# Altium project Gagabiro_POC_amp.PrjPcb
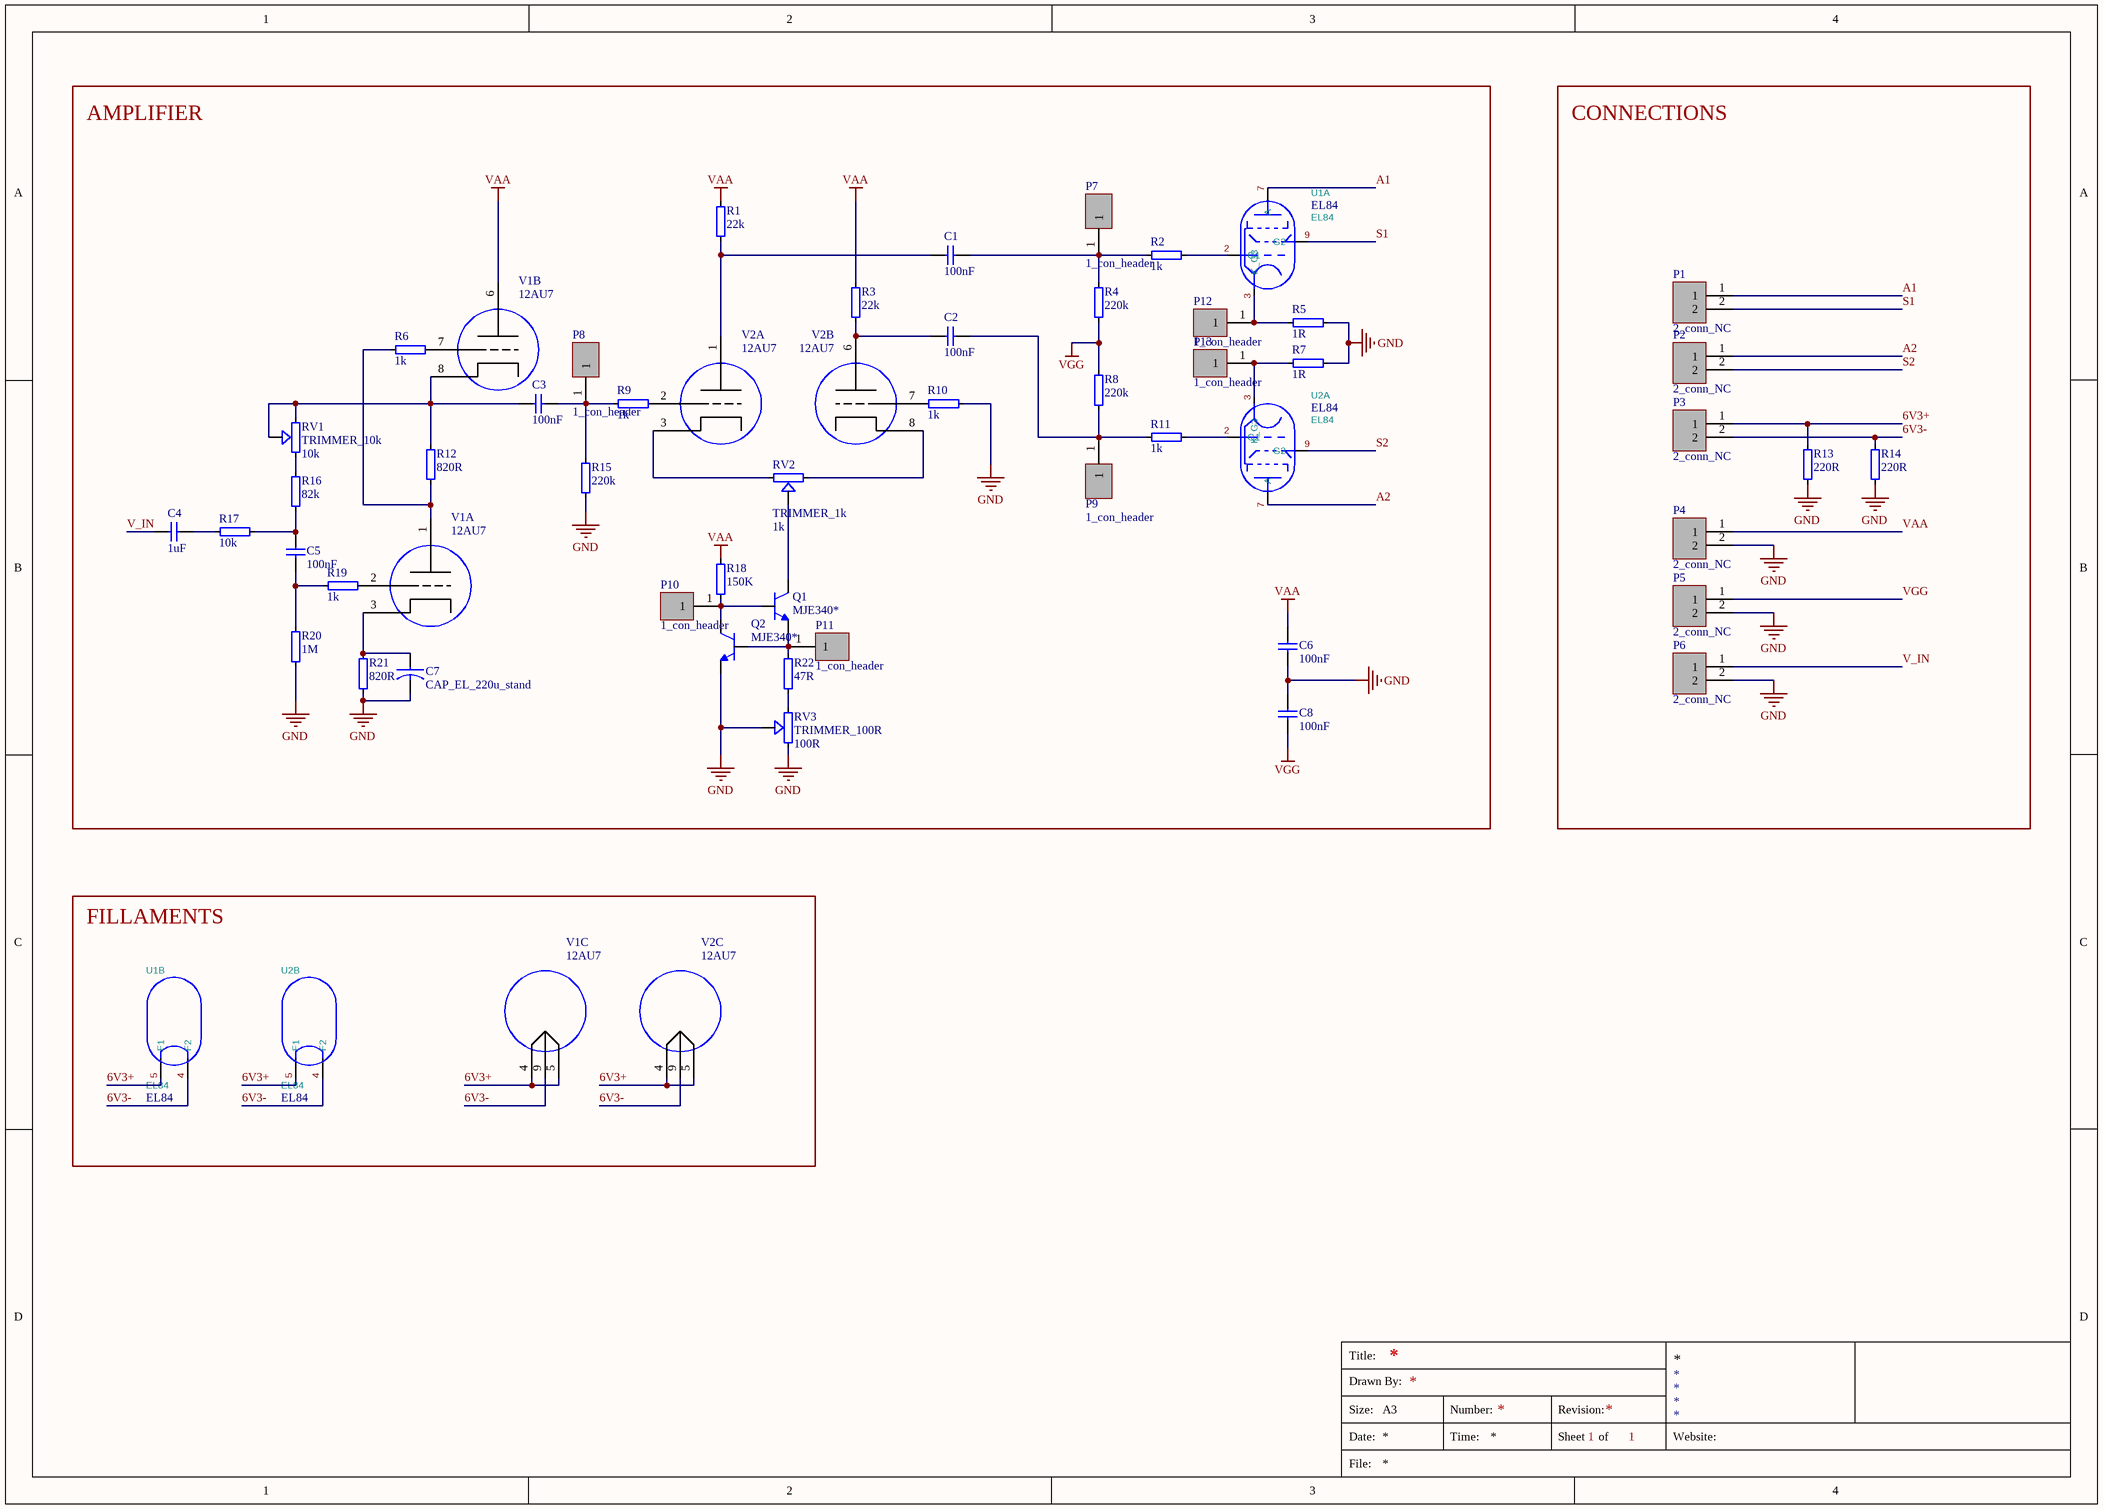
[diagram p0: Gagabiro_POC_amp_main.SchDoc]
1 sheet, 52 parts. Net scope: global (net labels, ports and power ports of the same name join across sheets).
Board file: Gagabiro_POC_amp.PcbDoc

## Sheet Gagabiro_POC_amp_main.SchDoc
size 393 x 281 mm; SheetNumber: 1; SheetTotal: 1

### Parts
C1  100nF  [CAP_panassonic_100n_450V]
C2  100nF  [CAP_panassonic_100n_450V]
C3  100nF  [CAP_panassonic_100n_450V]
C4  1uF  [CAP_panassonic_1u_450V]
C5  100nF  [CAP_panassonic_100n_450V]
C6  100nF  [CAP_panassonic_100n_450V]
C7  CAP_EL_220u_stand  [CAPPRD500W50D630H1120_stand]
C8  100nF  [CAP_panassonic_100n_450V]
P1  2_conn_NC  [2_conn_NC]
P2  2_conn_NC  [2_conn_NC]
P3  2_conn_NC  [2_conn_NC]
P4  2_conn_NC  [2_conn_NC]
P5  2_conn_NC  [2_conn_NC]
P6  2_conn_NC  [2_conn_NC]
P7  1_con_header  [SAMTEC_MTMM-101-X-X-S-X]
P8  1_con_header  [SAMTEC_MTMM-101-X-X-S-X]
P9  1_con_header  [SAMTEC_MTMM-101-X-X-S-X]
P10  1_con_header  [SAMTEC_MTMM-101-X-X-S-X]
P11  1_con_header  [SAMTEC_MTMM-101-X-X-S-X]
P12  1_con_header  [SAMTEC_MTMM-101-X-X-S-X]
P13  1_con_header  [SAMTEC_MTMM-101-X-X-S-X]
Q1  MJE340*  [TO126]
Q2  MJE340*  [TO126]
R1  22k  [RES_2W_vertical]
R2  1k  [RES_2W_vertical]
R3  22k  [RES_2W_vertical]
R4  220k  [RES_2W_vertical]
R5  1R  [RES_2W_vertical]
R6  1k  [RES_2W_vertical]
R7  1R  [RES_2W_vertical]
R8  220k  [RES_2W_vertical]
R9  1k  [RES_2W_vertical]
R10  1k  [RES_2W_vertical]
R11  1k  [RES_2W_vertical]
R12  820R  [RES_2W_vertical]
R13  220R  [RES_2W_vertical]
R14  220R  [RES_2W_vertical]
R15  220k  [RES_2W_vertical]
R16  82k  [RES_2W_vertical]
R17  10k  [RES_2W_vertical]
R18  150K  [RES_2W_vertical]
R19  1k  [RES_2W_vertical]
R20  1M  [RES_2W_vertical]
R21  820R  [RES_2W_vertical]
R22  47R  [RES_2W_vertical]
RV1  TRIMMER_10k  value 10k  [TRIM_PV36W204C01B00 - duplicate]
RV2  TRIMMER_1k  value 1k  [TRIM_PV36W204C01B00 - duplicate]
RV3  TRIMMER_100R  value 100R  [TRIM_PV36W204C01B00 - duplicate]
U1  EL84  [EL84]  (parts A,B of 2)
U2  EL84  [EL84]  (parts A,B of 2)
V1  12AU7  [12A_7]  (parts A,B,C of 3)
V2  12AU7  [12A_7]  (parts A,B,C of 3)

### Blocks framed on the sheet
AMPLIFIER: C1-C8 P7-P13 Q1 Q2 R1-R12 R15-R22 RV1-RV3 U1 U2 V1 V2
CONNECTIONS: P1-P6 R13 R14
FILLAMENTS: U1 U2 V1 V2

### Nets
GND: C6.1 C7.N C8.1 P4.2 P5.2 P6.2 Q2.1(E) R5.2 R7.2 R10.2 R13.1 R14.1 R15.1 R20.1 R21.1 RV3.1 RV3.2
VAA: C6.2 P4.1 R1.2 R3.2 R18.2 V1.6
VGG: C8.2 P5.1 R4.1 R8.1
6V3+: P3.1 R13.2 U1.5(F1) U2.5(F1) V1.4 V1.5 V2.4 V2.5
6V3-: P3.2 R14.2 U1.4(F2) U2.4(F2) V1.9 V2.9
A1: P1.1 U1.7(A)
A2: P2.1 U2.7(A)
S1: P1.2 U1.9(G2)
S2: P2.2 U2.9(G2)
V_IN: C4.1 P6.1
NetC1_1: C1.1 R1.1 V2.1
NetC1_2: C1.2 P7.1 R2.1 R4.2
NetC2_1: C2.1 R3.1 V2.6
NetC2_2: C2.2 P9.1 R8.2 R11.1
NetC3_1: C3.1 R12.2 RV1.2 RV1.3 V1.8
NetC3_2: C3.2 P8.1 R9.1 R15.2
NetC4_2: C4.2 R17.1
NetC5_1: C5.1 R19.1 R20.2
NetC5_2: C5.2 R16.1 R17.2
NetC7_P: C7.P R21.2 V1.3
NetP10_1: P10.1 Q1.3(B) Q2.2(C) R18.1
NetP11_1: P11.1 Q1.1(E) Q2.3(B) R22.2
NetP12_1: P12.1 R5.1 U1.3(K_G3)
NetP13_1: P13.1 R7.1 U2.3(K_G3)
NetQ1_2: Q1.2(C) RV2.2
NetR2_2: R2.2 U1.2(G1)
NetR6_1: R6.1 R12.1 V1.1
NetR6_2: R6.2 V1.7
NetR9_2: R9.2 V2.2
NetR10_1: R10.1 V2.7
NetR11_2: R11.2 U2.2(G1)
NetR16_2: R16.2 RV1.1
NetR19_2: R19.2 V1.2
NetR22_1: R22.1 RV3.3
NetRV2_1: RV2.1 V2.8
NetRV2_3: RV2.3 V2.3

### Notes on the sheet
- Title:
- Drawn By:
- Size:
- Date:
- File:
- A3
- Number:
- Time:
- Revision:
- Sheet
- of
- Website:

### Library data of the parts
C1-C3 C5 C6 C8 = CAP_POLY_100n: Capacitor, Silver Mica; Part Number: CMICA_47PF; Value: 100nF
C4 = CAP_POLY_1u: Capacitor, Silver Mica; Part Number: CMICA_47PF; Value: 1uF
C7 = CAP_EL_220u_stand: 220F 16V Aluminum Electrolytic Capacitors Radial, Can 1000 Hrs @ 105C; MP: EEU-HD1C221B; Value: 220uF; MF: Panasonic; Availability: In Stock; Purchase-URL: https://pricing.snapeda.com/search/part/EEU-HD1C221B/?ref=eda; Package: RADIAL-2 Panasonic; Check_prices: https://www.snapeda.com/parts/EEU-HD1C221B/Panasonic/view-part/?ref=eda; SnapEDA_Link: https://www.snapeda.com/parts/EEU-HD1C221B/Panasonic/view-part/?ref=snap; Price: None
P1-P6 = 2_conn_NC: Connector Header Surface Mount, Right Angle 2 position 0.079 (2.00mm); MP: S2B-PH-SM4-TB; MF: JST Sales; Price: None; Availability: In Stock; Package: None; Value: *; SnapEDA_Link: https://www.snapeda.com/parts/S2B-PH-SM4-TB/JST+Sales+America+Inc./view-part/?ref=snap; Purchase-URL: https://pricing.snapeda.com/search/part/S2B-PH-SM4-TB/?ref=eda; Check_prices: https://www.snapeda.com/parts/S2B-PH-SM4-TB/JST+Sales+America+Inc./view-part/?ref=eda
P7-P13 = 1_con_header: Connector Header Surface Mount, Right Angle 2 position 0.079 (2.00mm); MP: S2B-PH-SM4-TB; MF: JST Sales; Price: None; Availability: In Stock; Package: None; Value: *; SnapEDA_Link: https://www.snapeda.com/parts/S2B-PH-SM4-TB/JST+Sales+America+Inc./view-part/?ref=snap; Purchase-URL: https://pricing.snapeda.com/search/part/S2B-PH-SM4-TB/?ref=eda; Check_prices: https://www.snapeda.com/parts/S2B-PH-SM4-TB/JST+Sales+America+Inc./view-part/?ref=eda
Q1 Q2 = MJE340*: Bipolar (BJT) Transistor NPN 300 V 500 mA - 20.8 W Through Hole SOT-32-3; MF: STMicroelectronics; MP: MJE340; SnapEDA_Link: https://www.snapeda.com/parts/MJE340/STMicroelectronics/view-part/?ref=snap; Package: TO-126-3 Motorola; Value: *; Check_prices: https://www.snapeda.com/parts/MJE340/STMicroelectronics/view-part/?ref=eda
R1 R3 = R_2W_vertical_22k: Resistor, 2W; Part Number: R2W; ComponentLink1URL: N.A.; ComponentLink1Description: Datasheet; ComponentLink2URL: N.A.; ComponentLink2Description: Supplier link; Author: colombari; Value: 22k
R2 R6 R9-R11 R19 = R_2W_vertical_1k: Resistor, 2W; Part Number: R2W; ComponentLink1URL: N.A.; ComponentLink1Description: Datasheet; ComponentLink2URL: N.A.; ComponentLink2Description: Supplier link; Author: colombari; Value: 1k
R4 R8 R15 = R_2W_vertical_220k: Resistor, 2W; Part Number: R2W; ComponentLink1URL: N.A.; ComponentLink1Description: Datasheet; ComponentLink2URL: N.A.; ComponentLink2Description: Supplier link; Author: colombari; Value: 220k
R5 R7 = R_2W_vertical_1R: Resistor, 2W; Part Number: R2W; ComponentLink1URL: N.A.; ComponentLink1Description: Datasheet; ComponentLink2URL: N.A.; ComponentLink2Description: Supplier link; Author: colombari; Value: 1R
R12 R21 = R_2W_vertical_820R: Resistor, 2W; Part Number: R2W; ComponentLink1URL: N.A.; ComponentLink1Description: Datasheet; ComponentLink2URL: N.A.; ComponentLink2Description: Supplier link; Author: colombari; Value: 820R
R13 R14 = R_2W_vertical_220R: Resistor, 2W; Part Number: R2W; ComponentLink1URL: N.A.; ComponentLink1Description: Datasheet; ComponentLink2URL: N.A.; ComponentLink2Description: Supplier link; Author: colombari; Value: 220R
R16 = R_2W_vertical_82k: Resistor, 2W; Part Number: R2W; ComponentLink1URL: N.A.; ComponentLink1Description: Datasheet; ComponentLink2URL: N.A.; ComponentLink2Description: Supplier link; Author: colombari; Value: 82k
R17 = R_2W_vertical_10k: Resistor, 2W; Part Number: R2W; ComponentLink1URL: N.A.; ComponentLink1Description: Datasheet; ComponentLink2URL: N.A.; ComponentLink2Description: Supplier link; Author: colombari; Value: 10k
R18 = R_2W_vertical_150K: Resistor, 2W; Part Number: R2W; ComponentLink1URL: N.A.; ComponentLink1Description: Datasheet; ComponentLink2URL: N.A.; ComponentLink2Description: Supplier link; Author: colombari; Value: 150K
R20 = R_2W_vertical_1M: Resistor, 2W; Part Number: R2W; ComponentLink1URL: N.A.; ComponentLink1Description: Datasheet; ComponentLink2URL: N.A.; ComponentLink2Description: Supplier link; Author: colombari; Value: 1M
R22 = R_2W_vertical_47R: Resistor, 2W; Part Number: R2W; ComponentLink1URL: N.A.; ComponentLink1Description: Datasheet; ComponentLink2URL: N.A.; ComponentLink2Description: Supplier link; Author: colombari; Value: 47R
RV1 = TRIMMER_10k: TRIMMER; MF: Bourns Electronics; MP: PV36W204C01B00.; SnapEDA_Link: https://www.snapeda.com/parts/PV36W204C01B00./Bourns/view-part/?ref=snap; Package: None; Check_prices: https://www.snapeda.com/parts/PV36W204C01B00./Bourns/view-part/?ref=eda
RV2 = TRIMMER_1k: TRIMMER; MF: Bourns Electronics; MP: PV36W204C01B00.; SnapEDA_Link: https://www.snapeda.com/parts/PV36W204C01B00./Bourns/view-part/?ref=snap; Package: None; Check_prices: https://www.snapeda.com/parts/PV36W204C01B00./Bourns/view-part/?ref=eda
RV3 = TRIMMER_100R: TRIMMER; MF: Bourns Electronics; MP: PV36W204C01B00.; SnapEDA_Link: https://www.snapeda.com/parts/PV36W204C01B00./Bourns/view-part/?ref=snap; Package: None; Check_prices: https://www.snapeda.com/parts/PV36W204C01B00./Bourns/view-part/?ref=eda
V1 V2 = 12AU7: TUNGSOL 12AU7 NEW PRD PREAMP TB; MF: RCA; MP: 12AX7; SnapEDA_Link: https://www.snapeda.com/parts/12AX7/RCA/view-part/?ref=snap; Package: None; Check_prices: https://www.snapeda.com/parts/12AX7/RCA/view-part/?ref=eda; Value: *
U1 U2 = EL84: Footprint: Valve:Valve_Noval_P; Value: EL84